# EAGLE schematic Analog_V7 (EAGLE 9.6.2)
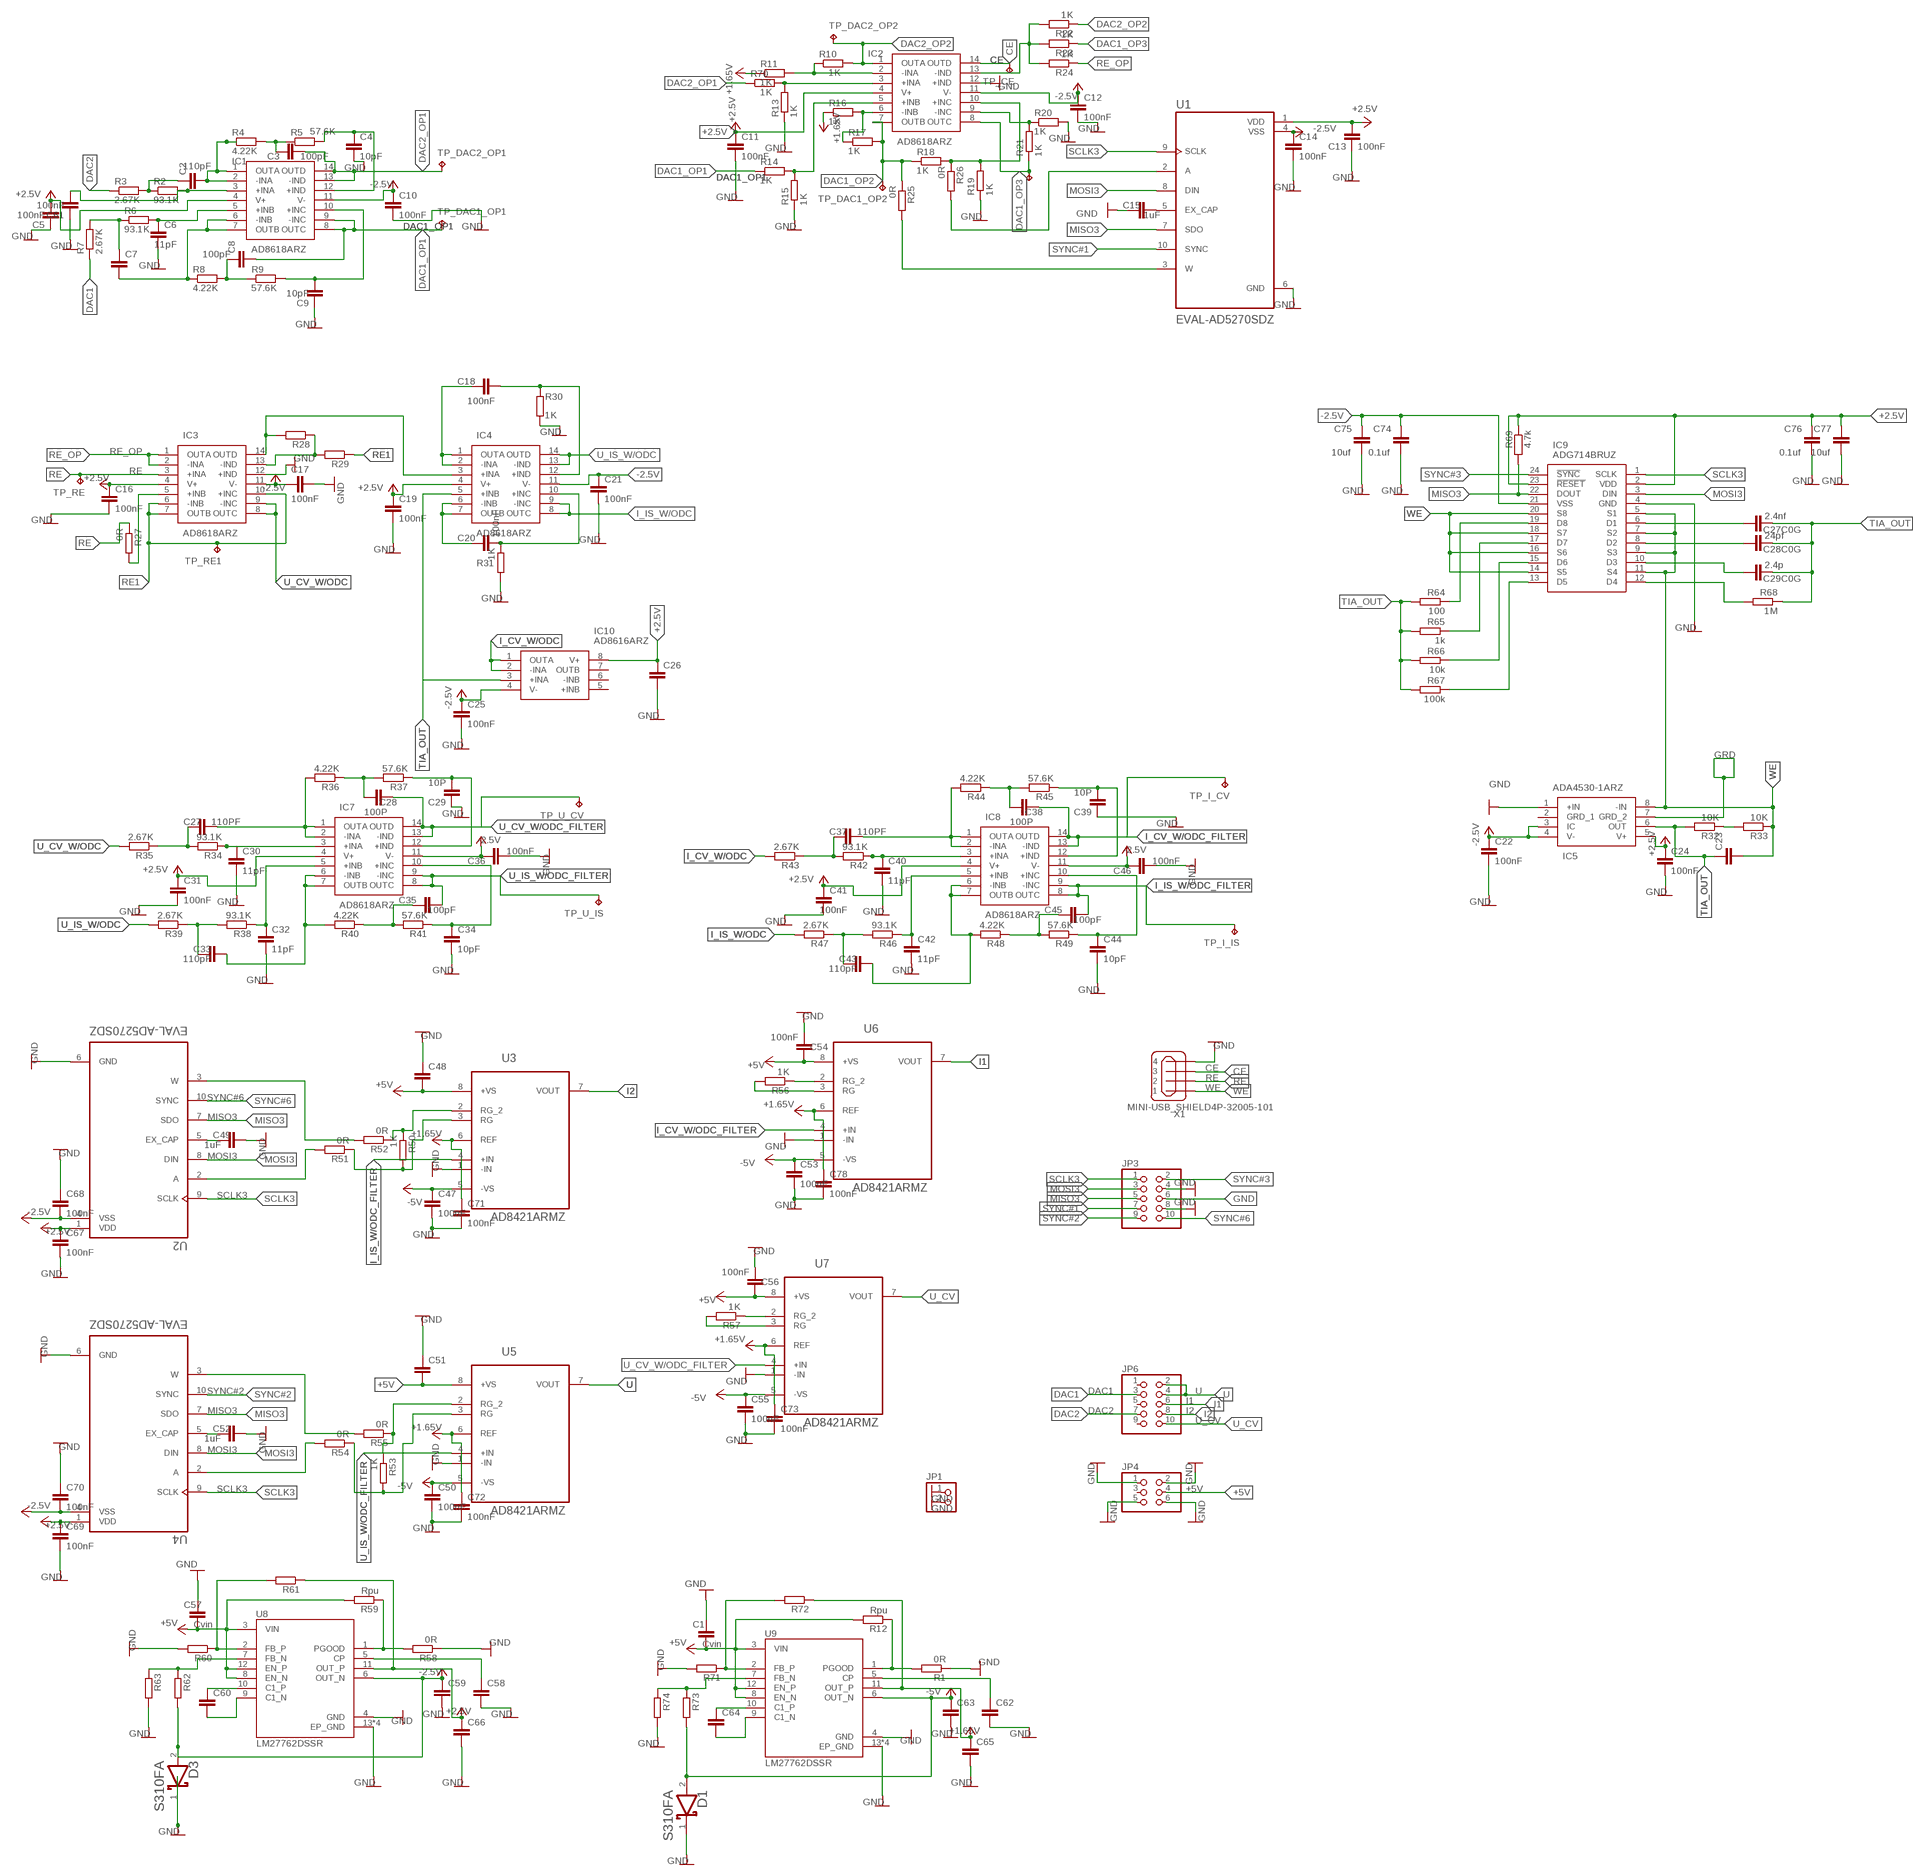
[diagram p0: schematic, sheet 1]

## Parts
C1  Cvin  C-EUC0805  [C0805]
C2  110pF  C-EUC0805  [C0805]
C3  100pF  C-EUC0805  [C0805]
C4  10pF  C-EUC0805  [C0805]
C5  100nF  C-EUC0805  [C0805]
C6  11pF  C-EUC0805  [C0805]
C7  C-EUC0805  [C0805]
C8  100pF  C-EUC0805  [C0805]
C9  10pF  C-EUC0805  [C0805]
C10  100nF  C-EUC0805  [C0805]
C11  100nF  C-EUC0805  [C0805]
C12  100nF  C-EUC0805  [C0805]
C13  100nF  C-EUC0805  [C0805]
C14  100nF  C-EUC0805  [C0805]
C15  1uF  C-EUC0805  [C0805]
C16  100nF  C-EUC0805  [C0805]
C17  100nF  C-EUC0805  [C0805]
C18  100nF  C-EUC0805  [C0805]
C19  100nF  C-EUC0805  [C0805]
C20  100nF  C-EUC0805  [C0805]
C21  100nF  C-EUC0805  [C0805]
C22  100nF  C-EUC0805  [C0805]
C23  C-EUC0805  [C0805]
C24  100nF  C-EUC0805  [C0805]
C25  100nF  C-EUC0805  [C0805]
C26  C-EUC0805  [C0805]
C27  110PF  C-EUC0805  [C0805]
C27C0G  2.4nf  C-EUC0603  [C0603]
C28  100P  C-EUC0805  [C0805]
C28C0G  24pf  C-EUC0603  [C0603]
C29  10P  C-EUC0805  [C0805]
C29C0G  2.4p  C-EUC0603  [C0603]
C30  11pF  C-EUC0805  [C0805]
C31  100nF  C-EUC0805  [C0805]
C32  11pF  C-EUC0805  [C0805]
C33  110pF  C-EUC0805  [C0805]
C34  10pF  C-EUC0805  [C0805]
C35  100pF  C-EUC0805  [C0805]
C36  100nF  C-EUC0805  [C0805]
C37  110PF  C-EUC0805  [C0805]
C38  100P  C-EUC0805  [C0805]
C39  10P  C-EUC0805  [C0805]
C40  11pF  C-EUC0805  [C0805]
C41  100nF  C-EUC0805  [C0805]
C42  11pF  C-EUC0805  [C0805]
C43  110pF  C-EUC0805  [C0805]
C44  10pF  C-EUC0805  [C0805]
C45  100pF  C-EUC0805  [C0805]
C46  100nF  C-EUC0805  [C0805]
C47  100nF  C-EUC0805  [C0805]
C48  C-EUC0805  [C0805]
C49  1uF  C-EUC0805  [C0805]
C50  100nF  C-EUC0805  [C0805]
C51  C-EUC0805  [C0805]
C52  1uF  C-EUC0805  [C0805]
C53  100nF  C-EUC0805  [C0805]
C54  100nF  C-EUC0805  [C0805]
C55  100nF  C-EUC0805  [C0805]
C56  100nF  C-EUC0805  [C0805]
C57  Cvin  C-EUC0805  [C0805]
C58  C-EUC0805  [C0805]
C59  C-EUC0805  [C0805]
C60  C-EUC0805  [C0805]
C61  100nF  C-EUC0805  [C0805]
C62  C-EUC0805  [C0805]
C63  C-EUC0805  [C0805]
C64  C-EUC0805  [C0805]
C65  C-EUC0805  [C0805]
C66  C-EUC0805  [C0805]
C67  100nF  C-EUC0805  [C0805]
C68  100nF  C-EUC0805  [C0805]
C69  100nF  C-EUC0805  [C0805]
C70  100nF  C-EUC0805  [C0805]
C71  100nF  C-EUC0805  [C0805]
C72  100nF  C-EUC0805  [C0805]
C73  100nF  C-EUC0805  [C0805]
C74  0.1uf  C-EUC0603  [C0603]
C75  10uf  C-EUC0603  [C0603]
C76  0.1uf  C-EUC0603  [C0603]
C77  10uf  C-EUC0603  [C0603]
C78  100nF  C-EUC0805  [C0805]
D1  ON_SEMICONDUCTOR_S310FAON_SEMICONDUCTOR_S310FA_0_0  [ON_SEMICONDUCTOR_S310FA_0]
D3  ON_SEMICONDUCTOR_S310FAON_SEMICONDUCTOR_S310FA_0_0  [ON_SEMICONDUCTOR_S310FA_0]
IC1  AD8618ARZ  [SOIC127P600X175-14N]
IC2  AD8618ARZ  [SOIC127P600X175-14N]
IC3  AD8618ARZ  [SOIC127P600X175-14N]
IC4  AD8618ARZ  [SOIC127P600X175-14N]
IC5  ADA4530-1ARZ  [SOIC127P600X175-8N]
IC7  AD8618ARZ  [SOIC127P600X175-14N]
IC8  AD8618ARZ  [SOIC127P600X175-14N]
IC9  ADG714BRUZ  [SOP65P640X120-24N]
IC10  AD8616ARZ  [SOIC127P600X175-8N]
JP1  PINHD-1X2  [1X02]
JP3  PINHD-2X5  [2X05]
JP4  PINHD-2X3  [2X03]
JP6  PINHD-2X5  [2X05]
R1  0R  R-EU_R0603  [R0603]
R2  93.1K  R-EU_R0603  [R0603]
R3  2.67K  R-EU_R0603  [R0603]
R4  4.22K  R-EU_R0603  [R0603]
R5  57.6K  R-EU_R0603  [R0603]
R6  93.1K  R-EU_R0603  [R0603]
R7  2.67K  R-EU_R0603  [R0603]
R8  4.22K  R-EU_R0603  [R0603]
R9  57.6K  R-EU_R0603  [R0603]
R10  1K  R-EU_R0603  [R0603]
R11  1K  R-EU_R0603  [R0603]
R12  Rpu  R-EU_R0603  [R0603]
R13  1K  R-EU_R0603  [R0603]
R14  1K  R-EU_R0603  [R0603]
R15  1K  R-EU_R0603  [R0603]
R16  1K  R-EU_R0603  [R0603]
R17  1K  R-EU_R0603  [R0603]
R18  1K  R-EU_R0603  [R0603]
R19  1K  R-EU_R0603  [R0603]
R20  1K  R-EU_R0603  [R0603]
R21  1K  R-EU_R0603  [R0603]
R22  1K  R-EU_R0603  [R0603]
R23  1K  R-EU_R0603  [R0603]
R24  1K  R-EU_R0603  [R0603]
R25  0R  R-EU_R0603  [R0603]
R26  0R  R-EU_R0603  [R0603]
R27  0R  R-EU_R0603  [R0603]
R28  R-EU_R0603  [R0603]
R29  R-EU_R0603  [R0603]
R30  1K  R-EU_R0603  [R0603]
R31  1K  R-EU_R0603  [R0603]
R32  10K  R-EU_R0603  [R0603]
R33  10K  R-EU_R0603  [R0603]
R34  93.1K  R-EU_R0603  [R0603]
R35  2.67K  R-EU_R0603  [R0603]
R36  4.22K  R-EU_R0603  [R0603]
R37  57.6K  R-EU_R0603  [R0603]
R38  93.1K  R-EU_R0603  [R0603]
R39  2.67K  R-EU_R0603  [R0603]
R40  4.22K  R-EU_R0603  [R0603]
R41  57.6K  R-EU_R0603  [R0603]
R42  93.1K  R-EU_R0603  [R0603]
R43  2.67K  R-EU_R0603  [R0603]
R44  4.22K  R-EU_R0603  [R0603]
R45  57.6K  R-EU_R0603  [R0603]
R46  93.1K  R-EU_R0603  [R0603]
R47  2.67K  R-EU_R0603  [R0603]
R48  4.22K  R-EU_R0603  [R0603]
R49  57.6K  R-EU_R0603  [R0603]
R50  1K  R-EU_R0603  [R0603]
R51  0R  R-EU_R0603  [R0603]
R52  0R  R-EU_R0603  [R0603]
R53  1K  R-EU_R0603  [R0603]
R54  0R  R-EU_R0603  [R0603]
R55  0R  R-EU_R0603  [R0603]
R56  1K  R-EU_R0603  [R0603]
R57  1K  R-EU_R0603  [R0603]
R58  0R  R-EU_R0603  [R0603]
R59  Rpu  R-EU_R0603  [R0603]
R60  R-EU_R0603  [R0603]
R61  R-EU_R0603  [R0603]
R62  R-EU_R0603  [R0603]
R63  R-EU_R0603  [R0603]
R64  100  R-EU_R0603  [R0603]
R65  1k  R-EU_R0603  [R0603]
R66  10k  R-EU_R0603  [R0603]
R67  100k  R-EU_R0603  [R0603]
R68  1M  R-EU_R0603  [R0603]
R69  4.7k  R-EU_R0603  [R0603]
R70  1K  R-EU_R0603  [R0603]
R71  R-EU_R0603  [R0603]
R72  R-EU_R0603  [R0603]
R73  R-EU_R0603  [R0603]
R74  R-EU_R0603  [R0603]
TP_CE  TPB1,27  [B1,27]
TP_DAC1_OP1  TP_DAC1_OP1  TPB1,27  [B1,27]
TP_DAC1_OP2  TPB1,27  [B1,27]
TP_DAC1_OP3  TPB1,27  [B1,27]
TP_DAC2_OP1  TP_DAC2_OP1  TPB1,27  [B1,27]
TP_DAC2_OP2  TP_DAC2_OP2  TPB1,27  [B1,27]
TP_I_CV  TPB1,27  [B1,27]
TP_I_IS  TPB1,27  [B1,27]
TP_RE  TPB1,27  [B1,27]
TP_RE1  TPB1,27  [B1,27]
TP_U_CV  TPB1,27  [B1,27]
TP_U_IS  TPB1,27  [B1,27]
U1  EVAL-AD5270SDZ  [SOP50P490X110-10N]
U2  EVAL-AD5270SDZ  [SOP50P490X110-10N]
U3  AD8421ARMZ  [SOP65P490X110-8N]
U4  EVAL-AD5270SDZ  [SOP50P490X110-10N]
U5  AD8421ARMZ  [SOP65P490X110-8N]
U6  AD8421ARMZ  [SOP65P490X110-8N]
U7  AD8421ARMZ  [SOP65P490X110-8N]
U8  LM27762DSSR  [VREG_LM27762DSSR]
U9  LM27762DSSR  [VREG_LM27762DSSR]
X1  MINI-USB_SHIELD4P-32005-101  [32005-101]

## Nets
+1.65V: C65.1 C71.1 C72.1 C73.1 C78.1 R11.1 R16.1 R72.1 U3.6(REF) U5.6(REF) U6.6(REF) U7.6(REF) U9.11(OUT_P)
+2.5V: C5.2 C11.1 C13.2 C16.1 C19.1 C24.1 C26.1 C31.1 C41.1 C66.1 C67.1 C69.1 C76.1 C77.1 IC1.4(V+) IC2.4(V+) IC3.4(V+) IC4.4(V+) IC5.5(V+) IC7.4(V+) IC8.4(V+) IC9.2(VDD) IC9.23(!RESET) IC10.8(V+) R61.1 R69.1 U1.1(VDD) U2.1(VDD) U4.1(VDD) U8.11(OUT_P)
+5V: C1.2 C48.2 C51.2 C54.2 C56.2 C57.2 JP4.4 R12.2 R59.2 U3.8(+VS) U5.8(+VS) U6.8(+VS) U7.8(+VS) U8.3(VIN) U8.8(EN_N) U8.12(EN_P) U9.3(VIN) U9.8(EN_N) U9.12(EN_P)
-2.5V: C10.1 C12.1 C14.1 C17.1 C21.1 C22.1 C25.1 C36.2 C46.2 C59.1 C68.2 C70.2 C74.1 C75.1 D3.2(ANODE) IC1.11(V-) IC2.11(V-) IC3.11(V-) IC4.11(V-) IC5.3(IC) IC5.4(V-) IC7.11(V-) IC8.11(V-) IC9.21(VSS) IC10.4(V-) R62.2 U1.4(VSS) U2.4(VSS) U4.4(VSS) U8.6(OUT_N)
-5V: C47.1 C50.1 C53.1 C55.1 C63.1 D1.2(ANODE) R73.2 U3.5(-VS) U5.5(-VS) U6.5(-VS) U7.5(-VS) U9.6(OUT_N)
CE: IC2.14(OUTD) TP_CE.TP X1.3
DAC1: JP6.3 R7.1
DAC1_OP1: C8.2 IC1.8(OUTC) IC1.9(-INC) R14.1 TP_DAC1_OP1.TP
DAC1_OP2: IC2.7(OUTB) R17.2 R18.1 R25.1 TP_DAC1_OP2.TP
DAC1_OP3: IC2.8(OUTC) R21.1 R23.1 TP_DAC1_OP3.TP
DAC2: JP6.7 R3.1
DAC2_OP1: C3.2 IC1.13(-IND) IC1.14(OUTD) R70.1 TP_DAC2_OP1.TP
DAC2_OP2: IC2.1(OUTA) R10.2 R22.1 TP_DAC2_OP2.TP
GND: C1.1 C4.2 C5.1 C6.2 C9.1 C10.2 C11.2 C12.2 C13.1 C14.2 C15.1 C16.2 C17.2 C19.2 C21.2 C22.2 C24.2 C25.2 C26.2 C29.1 C30.2 C31.2 C32.2 C34.2 C36.1 C39.1 C40.2 C41.2 C42.2 C44.2 C46.1 C47.2 C48.1 C49.2 C50.2 C51.1 C52.2 C53.2 C54.1 C55.2 C56.1 C57.1 C58.2 C59.2 C61.1 C62.2 C63.2 C65.2 C66.2 C67.2 C68.1 C69.2 C70.1 C71.2 C72.2 C73.2 C74.2 C75.2 C76.2 C77.2 C78.2 D1.1(CATHODE) D3.1(CATHODE) IC2.12(+IND) IC3.12(+IND) IC5.1(+IN) IC9.4(GND) JP1.1 JP1.2 JP3.4 JP3.6 JP3.8 JP4.1 JP4.2 JP4.5 JP4.6 R1.1 R13.1 R15.1 R19.1 R20.2 R30.2 R31.2 R58.1 R60.2 R63.2 R71.2 R74.2 U1.6(GND) U2.6(GND) U3.1(-IN) U5.1(-IN) U6.1(-IN) U7.1(-IN) U8.4(GND) U8.13(EP_GND) U8.13.1(EP_GND) U8.13.2(EP_GND) U8.13.3(EP_GND) U9.4(GND) U9.13(EP_GND) U9.13.1(EP_GND) U9.13.2(EP_GND) U9.13.3(EP_GND) X1.4
GND1: U4.6(GND) ; supply symbol labelled GND
GRD: IC5.7(GRD_2)
I1: JP6.6 U6.7(VOUT)
I2: JP6.8 U3.7(VOUT)
I_CV_W/ODC: IC10.1(OUTA) IC10.2(-INA) R43.2
I_CV_W/ODC_FILTER: C38.2 IC8.13(-IND) IC8.14(OUTD) TP_I_CV.TP U6.4(+IN)
I_IS_W/ODC: IC4.8(OUTC) IC4.9(-INC) R47.2
I_IS_W/ODC_FILTER: C45.2 IC8.8(OUTC) IC8.9(-INC) TP_I_IS.TP U3.4(+IN)
MISO3: IC9.22(DOUT) JP3.5 R69.2 U1.7(SDO) U2.7(SDO) U4.7(SDO)
MOSI3: IC9.3(DIN) JP3.3 U1.8(DIN) U2.8(DIN) U4.8(DIN)
N$1: C2.2 IC1.1(OUTA) IC1.2(-INA) R4.1
N$2: C7.2 IC1.6(-INB) IC1.7(OUTB) R8.1
N$3: IC2.9(-INC) R20.1 R21.2
N$4: C61.2 IC1.3(+INA) R2.2
N$5: C3.1 R4.2 R5.1
N$6: IC2.3(+INA) R13.2 R70.2
N$7: C6.1 IC1.5(+INB) R6.2
N$8: C7.1 R6.1 R7.2
N$9: IC2.2(-INA) R10.1 R11.2
N$10: C8.1 R8.2 R9.1
N$11: C9.2 IC1.10(+INC) R9.2
N$12: IC2.5(+INB) R14.2 R15.2
N$13: IC2.6(-INB) R16.2 R17.1
N$14: C4.1 IC1.12(+IND) R5.2
N$15: IC2.13(-IND) R22.2 R23.2 R24.2
N$16: R25.2 U1.3(W)
N$17: R26.2 U1.2(A)
N$18: C15.2 U1.5(EX_CAP)
N$19: IC3.5(+INB) R27.2
N$20: IC3.14(OUTD) IC4.3(+INA) R28.2
N$21: IC3.13(-IND) R28.1 R29.2
N$22: C18.1 IC4.1(OUTA) IC4.2(-INA)
N$23: C20.1 IC4.6(-INB) IC4.7(OUTB)
N$24: C27.2 IC7.1(OUTA) IC7.2(-INA) R36.2
N$25: IC9.19(D8) R64.1
N$26: R32.1 R33.2
N$27: C30.1 IC7.3(+INA) R34.1
N$28: C27.1 R34.2 R35.1
N$29: C28.1 R36.1 R37.2
N$30: C33.2 IC7.6(-INB) IC7.7(OUTB) R40.2
N$31: C33.1 R38.2 R39.1
N$32: C37.2 IC8.1(OUTA) IC8.2(-INA) R44.2
N$33: C32.1 IC7.5(+INB) R38.1
N$34: C35.1 R40.1 R41.2
N$35: C34.1 IC7.10(+INC) R41.1
N$36: C40.1 IC8.3(+INA) R42.1
N$37: C37.1 R42.2 R43.1
N$38: C38.1 R44.1 R45.2
N$39: C43.2 IC8.6(-INB) IC8.7(OUTB) R48.2
N$40: C43.1 R46.2 R47.1
N$41: C42.1 IC8.5(+INB) R46.1
N$42: C45.1 R48.1 R49.2
N$43: C44.1 IC8.10(+INC) R49.1
N$44: R50.1 R52.1 U3.2(RG_2)
N$45: R50.2 R51.1 U3.3(RG)
N$46: R52.2 U2.3(W)
N$47: R51.2 U2.2(A)
N$48: R56.1 U6.2(RG_2)
N$49: C49.1 U2.5(EX_CAP)
N$50: R53.1 R55.1 U5.2(RG_2)
N$51: C64.1 U9.10(C1_P)
N$52: R55.2 U4.3(W)
N$53: R54.2 U4.2(A)
N$54: R56.2 U6.3(RG)
N$55: C52.1 U4.5(EX_CAP)
N$56: R57.1 U7.2(RG_2)
N$57: C18.2 IC4.12(+IND) R30.1
N$58: R57.2 U7.3(RG)
N$60: IC9.17(D7) R65.1
N$61: IC9.15(D6) R66.1
N$62: IC9.13(D5) R67.1
N$63: C27C0G.2 IC9.6(D1)
N$64: C60.1 U8.10(C1_P)
N$65: C60.2 U8.9(C1_N)
N$66: C28C0G.2 IC9.8(D2)
N$67: C29C0G.2 IC9.10(D3)
N$68: IC9.12(D4) R68.2
N$69: C20.2 IC4.10(+INC) R31.1
N$70: C64.2 U9.9(C1_N)
N$71: R71.1 R72.2 U9.2(FB_P)
N$72: IC2.10(+INC) R18.2 R19.2 R26.1
N$73: R1.2 R12.1 U9.1(PGOOD)
N$74: C2.1 R2.1 R3.2
N$75: C29.2 IC7.12(+IND) R37.1
N$76: C39.2 IC8.12(+IND) R45.1
N$77: R53.2 R54.1 U5.3(RG)
N$78: R60.1 R61.2 U8.2(FB_P)
N$79: R58.2 R59.1 U8.1(PGOOD)
N$80: C58.1 U8.5(CP)
N$81: R62.1 R63.1 U8.7(FB_N)
N$82: C62.1 U9.5(CP)
N$83: R73.1 R74.1 U9.7(FB_N)
RE: IC3.3(+INA) R27.1 TP_RE.TP X1.2
RE1: IC3.6(-INB) IC3.7(OUTB) IC3.10(+INC) R29.1 TP_RE1.TP
RE_OP: IC3.1(OUTA) IC3.2(-INA) R24.1
SCLK3: IC9.1(SCLK) JP3.1 U1.9(SCLK) U2.9(SCLK) U4.9(SCLK)
SYNC#1: JP3.7 U1.10(SYNC)
SYNC#2: JP3.9 U4.10(SYNC)
SYNC#3: IC9.24(!SYNC) JP3.2
SYNC#6: JP3.10 U2.10(SYNC)
TIA_OUT: C23.1 C27C0G.1 C28C0G.1 C29C0G.1 IC4.5(+INB) IC5.6(OUT) IC10.3(+INA) R32.2 R64.2 R65.2 R66.2 R67.2 R68.1
U: JP6.2 JP6.4 U5.7(VOUT)
U_CV: JP6.10 U7.7(VOUT)
U_CV_W/ODC: IC3.8(OUTC) IC3.9(-INC) R35.2
U_CV_W/ODC_FILTER: C28.2 IC7.13(-IND) IC7.14(OUTD) TP_U_CV.TP U7.4(+IN)
U_IS_W/ODC: IC4.13(-IND) IC4.14(OUTD) R39.2
U_IS_W/ODC_FILTER: C35.2 IC7.8(OUTC) IC7.9(-INC) TP_U_IS.TP U5.4(+IN)
WE: C23.2 IC5.8(-IN) IC9.5(S1) IC9.7(S2) IC9.9(S3) IC9.11(S4) IC9.14(S5) IC9.16(S6) IC9.18(S7) IC9.20(S8) R33.1 X1.1
Unconnected: IC5.2(GRD_1) IC10.5(+INB) IC10.6(-INB) IC10.7(OUTB) JP4.3 JP6.1 JP6.5 JP6.9 X1.M1(S1) X1.M2(S2)

## Library data of the parts
C1-C27 C27C0G C28 C28C0G C29 C29C0G C30-C78 = rcl:C-EU: CAPACITOR, European symbol; SPICEPREFIX: C
D1 D3 = ON Semiconductor - S310FA (1):ON_SEMICONDUCTOR_S310FA: DIODE SCHOTTKY 100V 3A SOD123FA; AUTOMOTIVE: No; CAPACITANCE: 78pF; CENTROID_NOT_SPECIFIED: No; DATASHEET: https://www.onsemi.com/pub/Collateral/SS36FA-D.PDF; DEVICE_CLASS_L1: Discrete Semiconductors; DEVICE_CLASS_L2: Diodes; DEVICE_CLASS_L3: Schottky Diodes; DIGIKEY_DESCRIPTION: DIODE SCHOTTKY 100V 3A SOD123FA; DIGIKEY_PART_NUMBER: S310FACT-ND; FOOTPRINT_URL: https://www.onsemi.com/pub/Collateral/425AB.PDF; FOOTPRINT_VARIANT_NAME_0: Recommended_Land_Pattern; FORWARD_CURRENT: 3A; HEIGHT: 1.43mm; LEAD_FREE: Yes; MAX_JUNCTION_TEMP: +150°C; MAX_REPETITIVE_REVERSE_VOLTAGE: 100V; MAX_SURGE_FORWARD_CURRENT: 80A; MF: ON Semiconductor; MFG_PACKAGE_IDENT: 425AB; MFG_PACKAGE_IDENT_COMPONENT_ID: dabe0bdd8accd792; MFG_PACKAGE_IDENT_DATE: 08/2016; MFG_PACKAGE_IDENT_REV: O; MOUSER_DESCRIPTION: Schottky Diodes & Rectifiers 100V 3A Schottky Barrier Rectifier; MOUSER_PART_NUMBER: 512-S310FA; MPN: S310FA; PACKAGE: SOD-123FL; PEAK_REVERSE_CURRENT: 0.1mA; PREFIX: D; REVERSE_VOLTAGE: 100V; ROHS: Yes; TEMPERATURE_RANGE_HIGH: +150°C; TEMPERATURE_RANGE_LOW: -55°C; VERIFICATION_VERSION: 0.0.0.3
IC1-IC4 IC7 IC8 = EIS:AD8618ARZ: AD8618ARZ, Quad Operational Amplifier 24MHz CMOS, R-R, 3V, 14-Pin SOIC Source: Datasheet <http://www.analog.com/static/imported-files/data_sheets/AD8615_8616_8618.pdf>; DESCRIPTION: AD8618ARZ, Quad Operational Amplifier 24MHz CMOS, R-R, 3V, 14-Pin SOIC; HEIGHT: 1.75mm; MANUFACTURER_NAME: Analog Devices; MANUFACTURER_PART_NUMBER: AD8618ARZ; MOUSER_PART_NUMBER: 584-AD8618ARZ; MOUSER_PRICE-STOCK: https://www.mouser.com/Search/Refine.aspx?Keyword=584-AD8618ARZ; RS_PART_NUMBER: 5384959P; RS_PRICE-STOCK: http://uk.rs-online.com/web/p/products/5384959P
IC5 = EIS:ADA4530-1ARZ: Op Amp R-R O/P 8V/16V SOIC8 Analog Devices ADA4530-1ARZ Op Amp, 2MHz Rail-Rail, 4.5 16 V, 8-Pin SOIC Source: Datasheet <http://www.analog.com/media/en/technical-documentation/data-sheets/ADA4530-1.pdf>; DESCRIPTION: Op Amp R-R O/P 8V/16V SOIC8 Analog Devices ADA4530-1ARZ Op Amp, 2MHz Rail-Rail, 4.5 16 V, 8-Pin SOIC; HEIGHT: 1.75mm; MANUFACTURER_NAME: Analog Devices; MANUFACTURER_PART_NUMBER: ADA4530-1ARZ; MOUSER_PART_NUMBER: 584-ADA4530-1ARZ; MOUSER_PRICE-STOCK: https://www.mouser.com/Search/Refine.aspx?Keyword=584-ADA4530-1ARZ; RS_PART_NUMBER: 9155837P; RS_PRICE-STOCK: http://uk.rs-online.com/web/p/products/9155837P
IC9 = EIS:ADG714BRUZ: ADG714BRUZ, Analogue SPST Switch Octal SPST, 3 V, 5 V, 24-Pin, TSSOP, 8 Source: Datasheet <http://www.analog.com/media/en/technical-documentation/data-sheets/ADG714_715.pdf>; DESCRIPTION: ADG714BRUZ, Analogue SPST Switch Octal SPST, 3 V, 5 V, 24-Pin, TSSOP, 8; HEIGHT: 1.2mm; MANUFACTURER_NAME: Analog Devices; MANUFACTURER_PART_NUMBER: ADG714BRUZ; MOUSER_PART_NUMBER: 584-ADG714BRUZ; MOUSER_PRICE-STOCK: https://www.mouser.com/Search/Refine.aspx?Keyword=584-ADG714BRUZ; RS_PART_NUMBER: 5388333P; RS_PRICE-STOCK: http://uk.rs-online.com/web/p/products/5388333P
IC10 = EIS:AD8616ARZ: AD8616ARZ, Dual Operational Amplifier 24MHz CMOS, R-R, 3V, 8-Pin SOIC Source: Datasheet <http://www.analog.com/static/imported-files/data_sheets/AD8615_8616_8618.pdf>; DESCRIPTION: AD8616ARZ, Dual Operational Amplifier 24MHz CMOS, R-R, 3V, 8-Pin SOIC; HEIGHT: 1.75mm; MANUFACTURER_NAME: Analog Devices; MANUFACTURER_PART_NUMBER: AD8616ARZ; MOUSER_PART_NUMBER: 584-AD8616ARZ; MOUSER_PRICE-STOCK: https://www.mouser.com/Search/Refine.aspx?Keyword=584-AD8616ARZ; RS_PART_NUMBER: 5385356P; RS_PRICE-STOCK: http://uk.rs-online.com/web/p/products/5385356P
JP1 = pinhead:PINHD-1X2: PIN HEADER
JP3 JP6 = pinhead:PINHD-2X5: PIN HEADER
JP4 = pinhead:PINHD-2X3: PIN HEADER
R1-R74 = rcl:R-EU_: RESISTOR, European symbol; SPICEPREFIX: R
TP_CE TP_DAC1_OP1-TP_DAC1_OP3 TP_DAC2_OP1 TP_DAC2_OP2 TP_I_CV TP_I_IS TP_RE TP_RE1 TP_U_CV TP_U_IS = testpad:TP: Test pad
U1 = EVAL-AD5270SDZ (1):EVAL-AD5270SDZ: None Check prices <https://pricing.snapeda.com/parts/EVAL-AD5270SDZ/Analog%20Devices/view-part?ref=eda>; AVAILABILITY: Bad; DESCRIPTION: AD5270 Digital Potentiometer Data Acquisition Evaluation Board; MF: Analog Devices; MP: EVAL-AD5270SDZ; PACKAGE: MSOP-10 Analog Devices; PRICE: None; PURCHASE-URL: https://pricing.snapeda.com/search/part/EVAL-AD5270SDZ/?ref=eda
U2 U4 = EVAL-AD5270SDZ:EVAL-AD5270SDZ: None Check prices <https://pricing.snapeda.com/parts/EVAL-AD5270SDZ/Analog%20Devices/view-part?ref=eda>; AVAILABILITY: Bad; DESCRIPTION: AD5270 Digital Potentiometer Data Acquisition Evaluation Board; MF: Analog Devices; MP: EVAL-AD5270SDZ; PACKAGE: MSOP-10 Analog Devices; PRICE: None; PURCHASE-URL: https://pricing.snapeda.com/search/part/EVAL-AD5270SDZ/?ref=eda
U3 U5-U7 = AD8421ARMZ:AD8421ARMZ: Instrumentation Amplifier Check prices <https://pricing.snapeda.com/parts/AD8421ARMZ/Analog%20Devices/view-part?ref=eda>; AVAILABILITY: In Stock; DESCRIPTION: Instrumentation Amplifier 1 Circuit 8-MSOP; MF: Analog Devices; MP: AD8421ARMZ; PACKAGE: MSOP-8 Analog Devices; PRICE: None
U8 U9 = LM27762DSSR:LM27762DSSR: Low-Noise Positive- and Negative-Output Charge Pump With Integrated LDO 12-WSON -40 to 85 Check prices <https://pricing.snapeda.com/parts/LM27762DSSR/Texas%20Instruments/view-part?ref=eda>; AVAILABILITY: Good; DESCRIPTION: Low-Noise Positive- and Negative-Output Charge Pump With Integrated LDO 12-WSON -40 to 85; MF: Texas Instruments; MP: LM27762DSSR; PACKAGE: WSON-12 Texas Instruments; PRICE: None; PURCHASE-URL: https://pricing.snapeda.com/search/part/LM27762DSSR/?ref=eda
X1 = con-cypressindustries:MINI-USB_SHIELD4P-: MINI USB 4 Pol. Source: www.cypressindustries.com; OC_FARNELL: unknown; OC_NEWARK: unknown